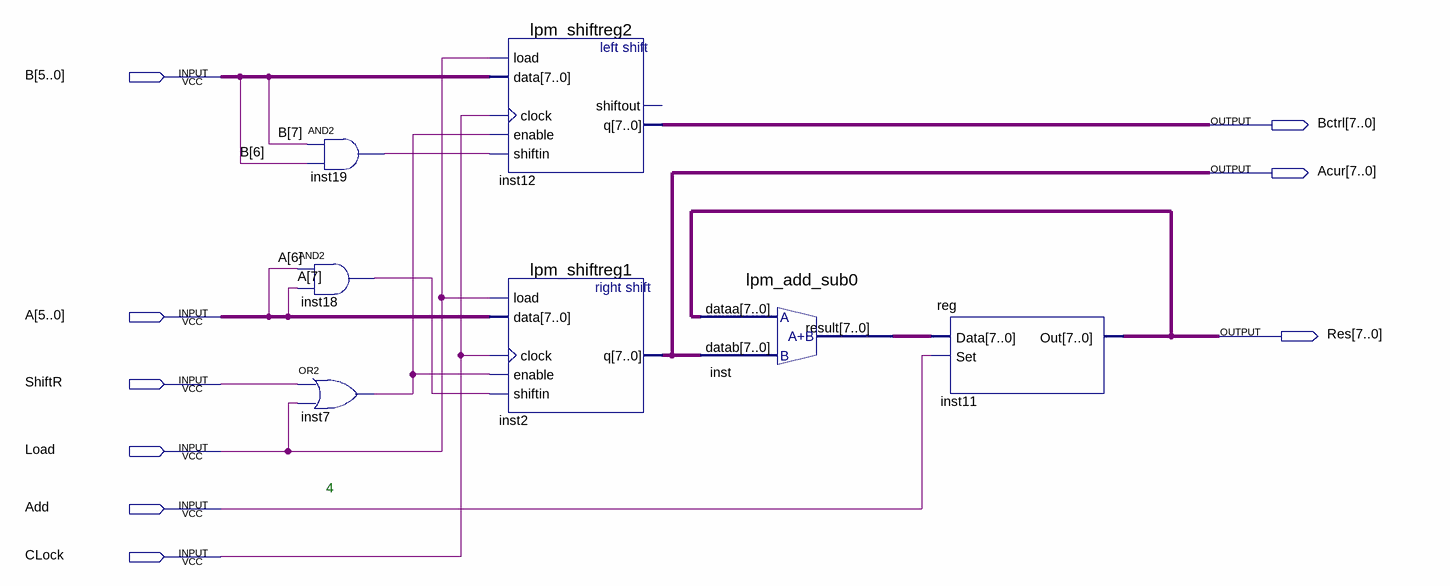
[diagram p0: schematic sheet]
// Quartus schematic TSTvict.bdf as structural Verilog: 7 symbols, 9 pins
module TSTvict (
  input  [7:0] B,
  input  [7:0] A,
  input  ShiftR,
  input  Load,
  input  Add,
  input  CLock,
  output [7:0] Bctrl,
  output [7:0] Acur,
  output [7:0] Res
);

  wire inst7_out, inst18_out, inst19_out;
  wire [7:0] inst_result;

  and inst19 (inst19_out, B[7], B[6]);
  and inst18 (inst18_out, A[6], A[7]);
  or inst7 (inst7_out, ShiftR, Load);
  lpm_shiftreg2 inst12 (
    .load(Load), .data(B[5:0]), .clock(CLock), .enable(inst7_out), .shiftin(inst19_out), .q(Bctrl));  // open: shiftout
  lpm_shiftreg1 inst2 (.load(Load), .data(A[5:0]), .clock(CLock), .enable(inst7_out), .shiftin(inst18_out), .q(Acur));
  lpm_add_sub0 inst (.dataa(Res), .datab(Acur), .result(inst_result));
  \reg  inst11 (.Data(inst_result), .Set(Add), .Out(Res));

  // Notes on the sheet:
  //   4
endmodule
